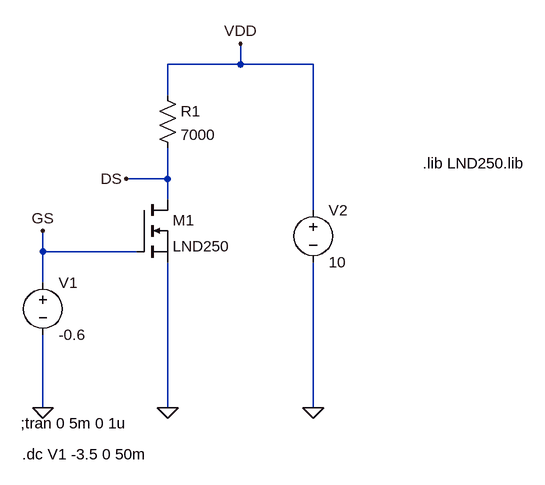
[diagram p0: schematic lnd250-sim.asc]
lnd250-sim.asc, the LTspice schematic file:
Version 4
SHEET 1 880 680
WIRE 336 -128 336 -160
WIRE 336 -128 224 -128
WIRE 448 -128 336 -128
WIRE 224 -80 224 -128
WIRE 224 48 224 0
WIRE 224 48 160 48
WIRE 224 80 224 48
WIRE 448 96 448 -128
WIRE 32 160 32 128
WIRE 176 160 32 160
WIRE 32 208 32 160
WIRE 32 400 32 288
WIRE 224 400 224 176
WIRE 448 400 448 176
FLAG 160 48 DS
FLAG 32 128 GS
FLAG 336 -160 VDD
FLAG 32 400 0
FLAG 224 400 0
FLAG 448 400 0
SYMBOL nmos 176 80 R0
SYMATTR InstName M1
SYMATTR Value LND250
SYMBOL voltage 32 192 R0
WINDOW 123 0 0 Left 0
WINDOW 39 0 0 Left 0
SYMATTR InstName V1
SYMATTR Value -0.6
SYMBOL res 208 -96 R0
SYMATTR InstName R1
SYMATTR Value 7000
SYMBOL voltage 448 80 R0
WINDOW 123 0 0 Left 0
WINDOW 39 0 0 Left 0
SYMATTR InstName V2
SYMATTR Value 10
TEXT 616 24 Left 2 !.lib LND250.lib
TEXT -2 424 Left 2 !;tran 0 5m 0 1u
TEXT 0 472 Left 2 !.dc V1 -3.5 0 50m

The netlist it stands for:
* lnd250-sim.asc
M1 DS GS 0 0 LND250
V1 GS 0 -0.6
R1 VDD DS 7000
V2 VDD 0 10
.model NMOS NMOS
.model PMOS PMOS
.lib standard.mos
.lib LND250.lib
;tran 0 5m 0 1u
.dc V1 -3.5 0 50m
.backanno
.end